# Altium project SensWear-V1R0.PrjPcb (part 1 of 2)
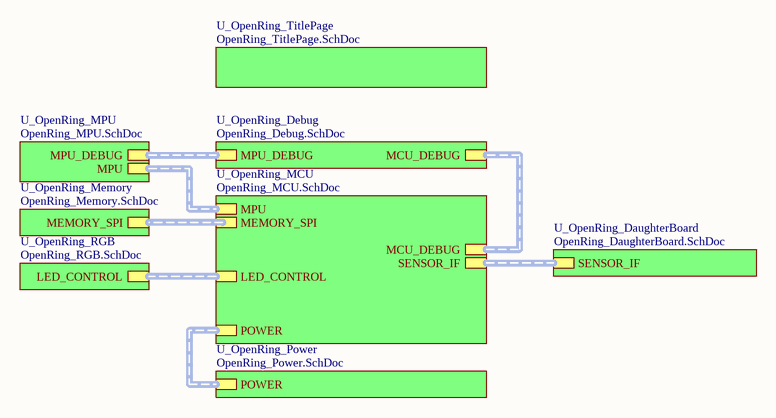
[diagram p0: SensWear-Main.SchDoc]
RevisionDate: 01.05.2025; Revision: A0; Project: SensWear-V1R0; Engineer: Yusein Ali; DrawnBy: Yusein Ali; BoardName: SensWear-RevA; ApprovedBy: Dariush Salami
9 sheets, 74 parts. Net scope: hierarchical (ports join the sheet entries above them; power ports are global).
Board file: SensWear-V1R0-MainBoard.PcbDoc
Sheets:
  SensWear-Main.SchDoc
  SensWear_MCU.SchDoc
  SensWear_Memory.SchDoc
  SensWear_Power.SchDoc
  SensWear_MPU.SchDoc
  SensWear_RGB.SchDoc
  SensWear_Debug.SchDoc
  SensWear_TitlePage.SchDoc
  SensWear_DaughterBoard.SchDoc

## Sheet SensWear-Main.SchDoc
size A4; Size: A4; ApprovedBy: Dariush Salami; DrawnBy: Yusein Ali; Engineer: Yusein Ali; Revision: A0; SheetNumber: 1; SheetTotal: 9

### Sub-sheets
U_OpenRing_DaughterBoard = OpenRing_DaughterBoard.SchDoc (file not in this document): SENSOR_IF (harness SENSOR_IF)
U_OpenRing_Debug = OpenRing_Debug.SchDoc (file not in this document): MPU_DEBUG (harness MPU_DEBUG), MCU_DEBUG (harness MCU_DEBUG)
U_OpenRing_MCU = OpenRing_MCU.SchDoc (file not in this document): MEMORY_SPI (harness MEMORY_SPI), MPU (harness MPU), SENSOR_IF (harness SENSOR_IF), POWER (harness POWER), MCU_DEBUG (harness MCU_DEBUG), LED_CONTROL (harness LED_CONTROL)
U_OpenRing_Memory = OpenRing_Memory.SchDoc (file not in this document): MEMORY_SPI (harness MEMORY_SPI)
U_OpenRing_MPU = OpenRing_MPU.SchDoc (file not in this document): MPU (harness MPU), MPU_DEBUG (harness MPU_DEBUG)
U_OpenRing_Power = OpenRing_Power.SchDoc (file not in this document): POWER (harness POWER)
U_OpenRing_RGB = OpenRing_RGB.SchDoc (file not in this document): LED_CONTROL (harness LED_CONTROL)
U_OpenRing_TitlePage = OpenRing_TitlePage.SchDoc (file not in this document): no entries

### Buses and harness runs
harness sheet U_OpenRing_DaughterBoard/SENSOR_IF = sheet U_OpenRing_MCU/SENSOR_IF
harness sheet U_OpenRing_Debug/MCU_DEBUG = sheet U_OpenRing_MCU/MCU_DEBUG
harness sheet U_OpenRing_Debug/MPU_DEBUG = sheet U_OpenRing_MPU/MPU_DEBUG
harness sheet U_OpenRing_MCU/LED_CONTROL = sheet U_OpenRing_RGB/LED_CONTROL
harness sheet U_OpenRing_MCU/MEMORY_SPI = sheet U_OpenRing_Memory/MEMORY_SPI
harness sheet U_OpenRing_MCU/MPU = sheet U_OpenRing_MPU/MPU
harness sheet U_OpenRing_MCU/POWER = sheet U_OpenRing_Power/POWER

### Notes on the sheet
- Designer/Engineer
- Drawn By
- Document Name
- Board Title
- Sheet
- of
- Size
- A4
- Approved By
- Rev.
- Date

## Sheet SensWear_MCU.SchDoc
size A3; Size: A4; ApprovedBy: Dariush Salami; DrawnBy: Yusein Ali; Engineer: Yusein Ali; Revision: A0; SheetNumber: 2; SheetTotal: 9
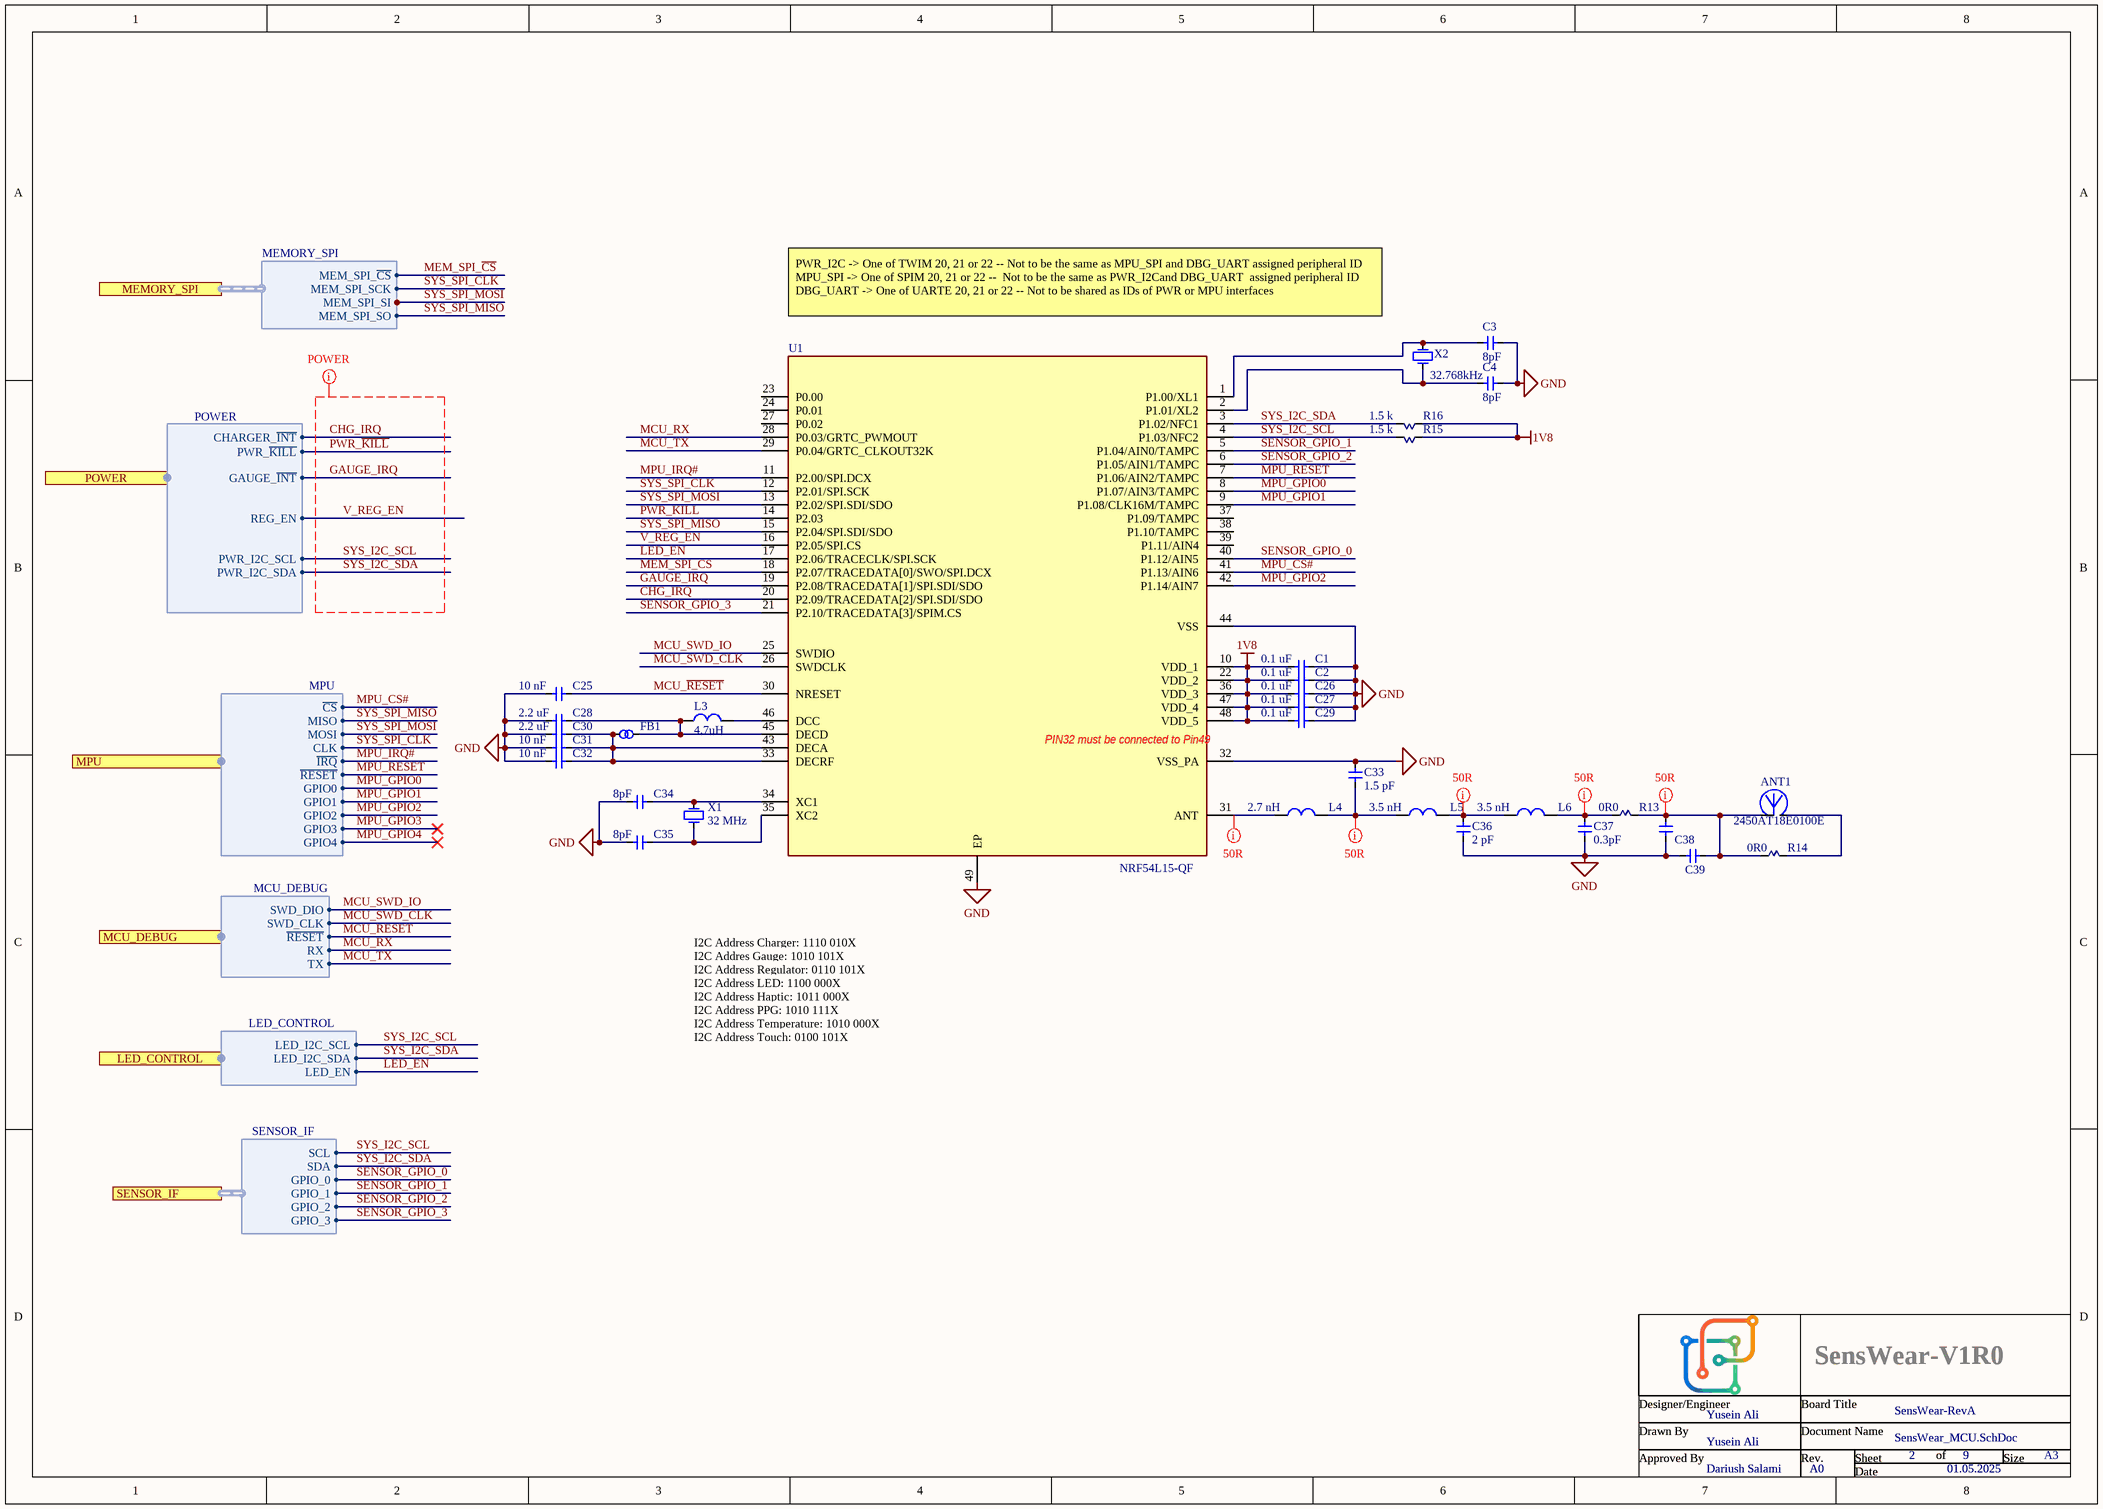
[diagram p1: SensWear_MCU.SchDoc]

### Parts
ANT1  2450AT18E0100E  [ANTC3216X130N]
C1  0.1 uF  [CAPC1005X05N]
C2  0.1 uF  [CAPC1005X05N]
C3  8pF  [CAPC1005X05N]
C4  8pF  [CAPC1005X05N]
C25  10 nF  [CAPC1005X05N]
C26  0.1 uF  [CAPC1005X05N]
C27  0.1 uF  [CAPC1005X05N]
C28  2.2 uF  [CAPC1005X05N]
C29  0.1 uF  [CAPC1005X05N]
C30  2.2 uF  [CAPC1005X05N]
C31  10 nF  [CAPC1005X05N]
C32  10 nF  [CAPC1005X05N]
C33  1.5 pF  [CAPC1005X05N]
C34  8pF  [CAPC1005X05N]
C35  8pF  [CAPC1005X05N]
C36  2 pF  [CAPC1005X05N]
C37  0.3pF  [INDC1005X06N]
C38  NC  [CAPC1005X05N]  (value not drawn)
C39  NC  [CAPC1005X05N]  (value not drawn)
FB1  BLM15AG121SN1D  [INDC1005X06N]  (value not drawn)
L3  4.7uH  [INDC1005X06N]
L4  2.7 nH  [INDC1005X06N]
L5  3.5 nH  [INDC1005X06N]
L6  3.5 nH  [INDC1005X06N]
R13  0R0  [RESC1005X04N]
R14  0R0  [RESC1005X04N]
R15  1.5 k  [RESC1005X04N]
R16  1.5 k  [RESC1005X04N]
U1  NRF54L15-QF  [QFN40P600X600X95-49N]
X1  32 MHz  [FP-ABM11W-MFG]
X2  32.768kHz  [Abracon_ABS6_2012X06L]

### Ports
LED_CONTROL (harness LED_CONTROL), MCU_DEBUG (harness MCU_DEBUG), MEMORY_SPI (harness MEMORY_SPI), MPU (harness MPU), POWER (harness POWER), SENSOR_IF (harness SENSOR_IF)

### Harnesses
MEMORY_SPI: MEM_SPI_~{CS}, MEM_SPI_SI, MEM_SPI_SO, MEM_SPI_SCK
MPU: ~{CS}, MISO, MOSI, CLK, ~{IRQ}, ~{RESET}, GPIO0, GPIO1, GPIO2, GPIO3, GPIO4
POWER: CHARGER_~{INT}, PWR_I2C_SCL, PWR_~{KILL}, GAUGE_~{INT}, PWR_I2C_SDA, REG_EN
MCU_DEBUG: SWD_DIO, SWD_CLK, ~{RESET}, RX, TX
SENSOR_IF: SCL, SDA, GPIO_0, GPIO_1, GPIO_2, GPIO_3
LED_CONTROL: LED_I2C_SCL, LED_I2C_SDA, LED_EN

### Nets
1V8: C1.1 C2.1 C26.1 C27.1 C29.1 R15.1 R16.1 U1.10(VDD_1) U1.22(VDD_2) U1.36(VDD_3) U1.47(VDD_4) U1.48(VDD_5)
GND: C1.2 C2.2 C3.2 C4.1 C25.1 C26.2 C27.2 C28.1 C29.2 C30.1 C31.1 C32.1 C33.2 C34.1 C35.1 C36.1 C37.1 C38.1 C39.2 U1.32(VSS_PA) U1.44(VSS) U1.49(EP)
CHG_IRQ: U1.20(P2.09/TRACEDATA[2]/SPI.SDI/SDO) ; port POWER.CHARGER_~{INT}
GAUGE_IRQ: U1.19(P2.08/TRACEDATA[1]/SPI.SDI/SDO) ; port POWER.GAUGE_~{INT}
LED_EN: U1.17(P2.06/TRACECLK/SPI.SCK) ; port LED_CONTROL.LED_EN
MCU_~{RESET}: C25.2 U1.30(NRESET) ; port MCU_DEBUG.~{RESET}
MCU_RX: U1.28(P0.03/GRTC_PWMOUT) ; port MCU_DEBUG.RX
MCU_SWD_CLK: U1.26(SWDCLK) ; port MCU_DEBUG.SWD_CLK
MCU_SWD_IO: U1.25(SWDIO) ; port MCU_DEBUG.SWD_DIO
MCU_TX: U1.29(P0.04/GRTC_CLKOUT32K) ; port MCU_DEBUG.TX
MEM_SPI_~{CS}: U1.18(P2.07/TRACEDATA[0]/SWO/SPI.DCX) ; port MEMORY_SPI.MEM_SPI_~{CS}
MPU_CS#: U1.41(P1.13/AIN6) ; port MPU.~{CS}
MPU_GPIO0: U1.8(P1.07/AIN3/TAMPC) ; port MPU.GPIO0
MPU_GPIO1: U1.9(P1.08/CLK16M/TAMPC) ; port MPU.GPIO1
MPU_GPIO2: U1.42(P1.14/AIN7) ; port MPU.GPIO2
MPU_GPIO3: port MPU.GPIO3
MPU_GPIO4: port MPU.GPIO4
MPU_IRQ#: U1.11(P2.00/SPI.DCX) ; port MPU.~{IRQ}
MPU_~{RESET}: U1.7(P1.06/AIN2/TAMPC) ; port MPU.~{RESET}
PWR_~{KILL}: U1.14(P2.03) ; port POWER.PWR_~{KILL}
SENSOR_GPIO_0: U1.40(P1.12/AIN5) ; port SENSOR_IF.GPIO_0
SENSOR_GPIO_1: U1.5(P1.04/AIN0/TAMPC) ; port SENSOR_IF.GPIO_1
SENSOR_GPIO_2: U1.6(P1.05/AIN1/TAMPC) ; port SENSOR_IF.GPIO_2
SENSOR_GPIO_3: U1.21(P2.10/TRACEDATA[3]/SPIM.CS) ; port SENSOR_IF.GPIO_3
SYS_I2C_SCL: R15.2 U1.4(P1.03/NFC2) ; port POWER.PWR_I2C_SCL, port SENSOR_IF.SCL, port LED_CONTROL.LED_I2C_SCL
SYS_I2C_SDA: R16.2 U1.3(P1.02/NFC1) ; port POWER.PWR_I2C_SDA, port SENSOR_IF.SDA, port LED_CONTROL.LED_I2C_SDA
SYS_SPI_CLK: U1.12(P2.01/SPI.SCK) ; port MEMORY_SPI.MEM_SPI_SCK, port MPU.CLK
SYS_SPI_MISO: U1.15(P2.04/SPI.SDI/SDO) ; port MEMORY_SPI.MEM_SPI_SO, port MPU.MISO
SYS_SPI_MOSI: U1.13(P2.02/SPI.SDI/SDO) ; port MEMORY_SPI.MEM_SPI_SI, port MPU.MOSI
V_REG_EN: U1.16(P2.05/SPI.CS) ; port POWER.REG_EN
NetANT1_1: ANT1.1 C38.2 C39.1 R13.2 R14.1
NetANT1_2: ANT1.2 R14.2
NetC3_1: C3.1 U1.1(P1.00/XL1) X2.2(OSC2)
NetC4_2: C4.2 U1.2(P1.01/XL2) X2.1(OSC1)
NetC28_2: C28.2 FB1.2 L3.1 U1.45(DECD)
NetC30_2: C30.2 C31.2 C32.2 FB1.1 U1.33(DECRF) U1.43(DECA)
NetC33_1: C33.1 L4.2 L5.1
NetC34_2: C34.2 U1.34(XC1) X1.3(OSC2)
NetC35_2: C35.2 U1.35(XC2) X1.1(OSC1)
NetC36_2: C36.2 L5.2 L6.1
NetC37_2: C37.2 L6.2 R13.1
NetL3_2: L3.2 U1.46(DCC)
NetL4_1: L4.1 U1.31(ANT)

Not connected (* = marked no-connect by the designer): U1 23(P0.00) 24(P0.01) 27(P0.02) 37(P1.09/TAMPC) 38(P1.10/TAMPC) 39(P1.11/AIN4)

### Layout directives
net class PWR Control: CHG_IRQ, GAUGE_IRQ, PWR_~{KILL}, SYS_I2C_SCL, SYS_I2C_SDA, V_REG_EN
Impedance: 50; rule Width Constraint [Pref Impedance = 50.00ohms    Min Impedance = 50.00ohms    Max Impedance = 50.00ohms]: NetANT1_1, NetC33_1, NetC36_2, NetC37_2, NetL4_1

### Notes on the sheet
- PWR_I2C -> One of TWIM 20, 21 or 22 -- Not to be the same as MPU_SPI and DBG_UART assigned peripheral ID
  MPU_SPI -> One of SPIM 20, 21 or 22 --  Not to be the same as PWR_I2Cand DBG_UART  assigned peripheral ID
  DBG_UART -> One of UARTE 20, 21 or 22 -- Not to be shared as IDs of PWR or MPU interfaces
- (near U1) PIN32 must be connected to Pin49
- I2C Address Charger: 1110 010X
- I2C Addres Gauge: 1010 101X
- I2C Address Regulator: 0110 101X
- I2C Address LED: 1100 000X
- I2C Address Haptic: 1011 000X
- I2C Address PPG: 1010 111X
- I2C Address Temperature: 1010 000X
- I2C Address Touch: 0100 101X
- Designer/Engineer
- Drawn By
- Document Name
- Board Title
- Sheet
- of
- Size
- A3
- Approved By
- Rev.
- Date

### Library data of the parts
ANT1 = 2450AT18E0100E: 7 Inch Reel / Mini 2.45Ghz Chip Antenna; Manufacturer: Johanson; Checked: TRUE; Supplier: Mouser; Supplier Part Number: 609-2450AT18E0100E; Manufacturer Part Number: 2450AT18E0100E; RoHS: Yes; Category: RF Antennas; Stock: 4431; Pricing: 1=0.69, 10=0.624, 50=0.624, 100=0.479, 1000=0.303, 10000=0.245 (USD); ComponentLink1URL: https://datasheet.ciiva.com/24048/antenna-2450at18e0100-253355-24048542.pdf?src-supplier=Mouser; ComponentLink1Description: https://datasheet.ciiva.com/24048/antenna-2450at18e0100-253355-24048542.pdf?src-supplier=Mouser; Supplier 1: Mouser; Supplier Part Number 1: 609-2450AT18E0100E
C1 C2 C26 C27 C29 = GRM155R61C104KA88D: CAP CER 0.1UF 16V X5R 0402; Manufacturer: Murata Electronics; Tolerance: 10 %; Type: Chip Multilayer Ceramic Capacitor for General Purpose; Voltage Rating DC: 16 VDC; Capacitance - nF: 100 nF; Capacitance - pF: 100000 pF; Manufacturer Part Number: GRM155R61C104KA88D; RoHS: RoHS Compliant; Category: Multilayer Ceramic Capacitors MLCC - SMD/SMT; Stock: 0; Pricing: 1=0.082, 10=0.026, 100=0.011, 500=0.008, 1000=0.007, 2500=0.006, 5000=0.005, 10000=0.004 (EUR); Capacitance: 0.1 uF; Height: 0.5 mm; Length: 1 mm; Package / Case: 0402 (1005 metric); Packaging: Cut Tape; Product: General Type MLCCs; Series: GRM; Termination Style: SMD/SMT; Width: 0.5 mm; Brand: Murata Electronics; Case Code - in: 0402; Case Code - mm: 1005; Dielectric: X5R; Maximum Operating Temperature: + 85 C; Minimum Operating Temperature: - 55 C; Standard Pack Qty: 10000; Termination: Standard; RoHS - Mouser: Y; Minimum Order Quantity: 1; Reeling: True; ComponentLink1URL: http://www.mouser.com/datasheet/2/281/murata_03052018_GRM_Series_1-1310166.pdf; ComponentLink1Description: http://www.mouser.com/datasheet/2/281/murata_03052018_GRM_Series_1-1310166.pdf; Value: 0.1 uF; Supplier 1: Mouser; Supplier Part Number 1: 81-GRM155R61C104KA8D; Supplier 2: Digikey; Supplier Part Number 2: 490-5415-1-ND; Supplier 3: Digikey; Supplier Part Number 3: 490-5415-6-ND
C3 C4 C34 C35 = GRM1555C1H8R0BA01D: Multilayer Ceramic Capacitors MLCC - SMD/SMT 0402 8.0pF 50volts C0G +/-0.05pF; Manufacturer: Murata; Voltage Rating: 50V; Supplier: Digi-Key; Supplier Part Number: 490-8230-1-ND; Manufacturer Part Number: GRM1555C1H8R0BA01D; RoHS: Yes; Category: Ceramic Capacitors; Stock: 671988; Pricing: 1=0,1, 10=0,051, 50=0,0278, 100=0,0227, 500=0,01624, 1000=0,01276, 2500=0,0116, 5000=0,01067 (USD); Mounting Technology: Surface Mount; Case/Package: 0402; Case Code (Metric): 1005; Case Code (Imperial): 0402; Min Operating Temperature: -55°C; Max Operating Temperature: 125°C; Value: 8pF; Package Quantity: 1; Packaging: Tape and Reel; Series: GRM; Termination: SMD/SMT; Voltage Rating (DC): 50V; Dielectric: C0G; Construction: Flat; Length: 1mm; Width: 0.02inch; Height: 0.5mm; Thickness: 0.022inch; Depth: 0.5mm; Radiation Hardening: No; RoHS Compliant: Yes; Lead Free: Lead Free; ComponentLink1URL: https://datasheet.ciiva.com/18184/getdatasheetpartid-319021-18184500.pdf?src-supplier=Verical; ComponentLink1Description: https://datasheet.ciiva.com/18184/getdatasheetpartid-319021-18184500.pdf?src-supplier=Verical; ComponentLink2URL: https://datasheet.ciiva.com/6263/grm1555c1h820ga01-01-6263780.pdf?src-supplier=Digi-Key; ComponentLink2Description: https://datasheet.ciiva.com/6263/grm1555c1h820ga01-01-6263780.pdf?src-supplier=Digi-Key; ComponentLink3URL: https://datasheet.ciiva.com/5432/product-5432205.pdf?src-supplier=Mouser; ComponentLink3Description: https://datasheet.ciiva.com/5432/product-5432205.pdf?src-supplier=Mouser; ComponentLink4URL: https://datasheet.ciiva.com/11610/product-11610151.pdf?src-supplier=Avnet; ComponentLink4Description: https://datasheet.ciiva.com/11610/product-11610151.pdf?src-supplier=Avnet; ComponentLink5URL: https://datasheet.ciiva.com/16495/c02e-16495287.pdf?src-supplier=Future+Electronics; ComponentLink5Description: https://datasheet.ciiva.com/16495/c02e-16495287.pdf?src-supplier=Future+Electronics; ComponentLink6URL: https://datasheet.ciiva.com/5442/product-5442458.pdf?src-supplier=Mouser; ComponentLink6Description: https://datasheet.ciiva.com/5442/product-5442458.pdf?src-supplier=Mouser; Supplier 1: Mouser; Supplier Part Number 1: 81-GRM1555C1H8R0BA1D; Supplier 2: Digikey; Supplier Part Number 2: 490-8230-1-ND; Supplier 3: Digikey; Supplier Part Number 3: 490-8230-6-ND
C25 C31 C32 = GRM155R71H103KA88D: CAP CER 10000PF 50V X7R 0402; Manufacturer: Murata Electronics North America; Tolerance: ±10%; Supplier 1: Digi-Key; Manufacturer Part Number: GRM155R71H103KA88D; RoHS: RoHS Compliant; Category: Capacitors; Stock 1: 7217649; Pricing 1: 1=0.11, 50=0.0056, 100=0.0047, 250=0.00384, 500=0.0033, 1000=0.00256, 5000=0.00213 (GBP); Packaging: Digi-Reel®; Part Status: Active; Capacitance: 10000pF; Voltage - Rated: 50V; Temperature Coefficient: X7R; Mounting Type: Surface Mount, MLCC; Operating Temperature: -55°C ~ 125°C; Applications: General Purpose; Ratings: -; Package / Case: 0402 (1005 Metric); Size / Dimension: 0.039" L x 0.020" W (1.00mm x 0.50mm); Height - Seated (Max): -; Thickness (Max): 0.022" (0.55mm); Lead Spacing: -; Features: -; Lead Style: -; ComponentLink1URL: http://www.murata.com/~/media/webrenewal/support/library/catalog/products/capacitor/mlcc/c02e.pdf; ComponentLink1Description: http://www.murata.com/~/media/webrenewal/support/library/catalog/products/capacitor/mlcc/c02e.pdf; Supplier Part Number 1: 490-4516-6-ND; Value: 10 nF
C28 C30 = GRM155R61A225KE95D: CAP CER 2.2UF 10V X5R 0402; Manufacturer: Murata Electronics North America; Capacitance: 2.2µF; Tolerance: ±10%; Supplier 1: Digi-Key; Manufacturer Part Number: GRM155R61A225KE95D; RoHS: RoHS Compliant; Category: Capacitors; Stock 1: 370562; Pricing 1: 1=0.1, 10=0.06, 50=0.0326, 100=0.0275, 250=0.02252, 500=0.01926, 1000=0.015, 5000=0.0125 (USD); Packaging: Digi-Reel®; Part Status: Active; Voltage - Rated: 10V; Temperature Coefficient: X5R; Operating Temperature: -55°C ~ 85°C; Features: Derating Recommended; Ratings: -; Applications: General Purpose; Mounting Type: Surface Mount, MLCC; Package / Case: 0402 (1005 Metric); Size / Dimension: 0.039" L x 0.020" W (1.00mm x 0.50mm); Height - Seated (Max): -; Thickness (Max): 0.022" (0.55mm); Lead Spacing: -; Lead Style: -; ComponentLink1URL: http://www.murata.com/~/media/webrenewal/support/library/catalog/products/capacitor/mlcc/c02e.ashx; ComponentLink1Description: http://www.murata.com/~/media/webrenewal/support/library/catalog/products/capacitor/mlcc/c02e.ashx; Supplier Part Number 1: 490-10451-6-ND; Value: 2.2 uF
C33 = GJM1555C1H1R5BB01D: Multilayer Ceramic Capacitor, 1.5 pF, 50 V, ï¿½ 0.1pF, C0G (NP0), 0402 [1005 Metric]; Manufacturer: Murata; Material: 4241ConductorMaterial; Supplier: Mouser; Supplier Part Number: 81-GJM1555C1H1R5BB1D; Manufacturer Part Number: GJM1555C1H1R5BB01D; RoHS: Yes; Category: Ceramic Capacitors; Stock: 9670; Pricing: 1=0.1, 10=0.05, 50=0.05, 100=0.03, 1000=0.022, 10000=0.011 (USD); Lead Free: 5697LeadFree; ComponentLink1URL: https://datasheet.ciiva.com/8030/1700191-8030107.pdf?src-supplier=Element14; ComponentLink1Description: https://datasheet.ciiva.com/8030/1700191-8030107.pdf?src-supplier=Element14; ComponentLink2URL: https://datasheet.ciiva.com/26843/getdatasheetpartid-698463-26843693.pdf?src-supplier=Verical; ComponentLink2Description: https://datasheet.ciiva.com/26843/getdatasheetpartid-698463-26843693.pdf?src-supplier=Verical; ComponentLink3URL: https://datasheet.ciiva.com/29542/partnumbering-e-01-29542725.pdf?src-supplier=Digikey; ComponentLink3Description: https://datasheet.ciiva.com/29542/partnumbering-e-01-29542725.pdf?src-supplier=Digikey; ComponentLink4URL: https://datasheet.ciiva.com/29542/partnumbering-e-01-29542726.pdf?src-supplier=Digikey; ComponentLink4Description: https://datasheet.ciiva.com/29542/partnumbering-e-01-29542726.pdf?src-supplier=Digikey; ComponentLink5URL: https://datasheet.ciiva.com/16440/l0005e-16440473.pdf?src-supplier=Future+Electronics; ComponentLink5Description: https://datasheet.ciiva.com/16440/l0005e-16440473.pdf?src-supplier=Future+Electronics; Value: 1.5 pF; Supplier 1: Mouser; Supplier Part Number 1: 81-GJM1555C1H1R5BB1D; Supplier 2: Digikey; Supplier Part Number 2: 490-8087-1-ND; Supplier 3: Digikey; Supplier Part Number 3: 490-8087-6-ND
C36 = GJM1555C1H2R0WB01D: 0402 2 pF 50V ±0.05 pF Tolerance C0G SMT Multilayer Ceramic Capacitor; Manufacturer: Murata; Material: 4241ConductorMaterial; Temperature Coefficient: 30ppm/°C; Supplier: Mouser; Supplier Part Number: 81-GJM1555C1H2R0WB1D; Manufacturer Part Number: GJM1555C1H2R0WB01D; RoHS: Yes; Category: Ceramic Capacitors; Stock: 97187; Pricing: 1=0.14, 10=0.077, 50=0.077, 100=0.047, 1000=0.032, 10000=0.019 (USD); Lead Free: 5697LeadFree; ComponentLink1URL: https://datasheet.ciiva.com/26843/getdatasheetpartid-724043-26843695.pdf?src-supplier=Verical; ComponentLink1Description: https://datasheet.ciiva.com/26843/getdatasheetpartid-724043-26843695.pdf?src-supplier=Verical; Supplier 1: Mouser; Supplier Part Number 1: 81-GJM1555C1H2R0WB1D; Supplier 2: Digikey; Supplier Part Number 2: 490-11205-1-ND; Supplier 3: Digikey; Supplier Part Number 3: 490-11205-6-ND; Value: 2 pF
C37 = GJM1555C1HR30WB01D: 0402 0.3 pF 50V ±0.05 pF Tolerance C0G SMT Multilayer Ceramic Capacitor; Manufacturer: Murata; Material: 4241ConductorMaterial; Temperature Coefficient: 30ppm/°C; Supplier: Mouser; Supplier Part Number: 81-GJM1555C1HR30WB1D; Manufacturer Part Number: GJM1555C1HR30WB01D; RoHS: Yes; Category: Ceramic Capacitors; Stock: 24305; Pricing: 1=0.14, 10=0.077, 50=0.077, 100=0.047, 1000=0.031, 10000=0.021 (USD); Mounting Technology: Surface Mount; Case/Package: 0402; Case Code (Metric): 1005; Case Code (Imperial): 0402; Min Operating Temperature: -55°C; Max Operating Temperature: 125°C; Value: 0.3pF; Dielectric: C0G; Voltage Rating (DC): 50V; Packaging: Tape and Reel; Package Quantity: 10000; Termination: SMD/SMT; Series: GJM; Construction: Flat; Voltage Rating: 50V; Length: 1mm; Width: 0.02inch; Height: 0.5mm; Thickness: 0.022inch; Depth: 0.5mm; Radiation Hardening: No; RoHS Compliant: Yes; Lead Free: Lead Free; ComponentLink1URL: https://datasheet.ciiva.com/11617/product-11617574.pdf?src-supplier=Avnet; ComponentLink1Description: https://datasheet.ciiva.com/11617/product-11617574.pdf?src-supplier=Avnet; ComponentLink2URL: https://datasheet.ciiva.com/169/partnumbering-e-01-169995.pdf?src-supplier=Digikey; ComponentLink2Description: https://datasheet.ciiva.com/169/partnumbering-e-01-169995.pdf?src-supplier=Digikey; Supplier 1: Mouser; Supplier Part Number 1: 81-GJM1555C1HR30WB1D; Supplier 2: Digikey; Supplier Part Number 2: 490-11248-1-ND; Supplier 3: Digikey; Supplier Part Number 3: 490-11248-6-ND
C38 C39 = CAPACITOR
FB1 = BLM15AG121SN1D: Ferrite Beads Multi-Layer 120Ohm 25% 100MHz 550mA 190mOhm DCR 0402 Paper T/R; Manufacturer: Murata; Manufacturer Series: BLM15A; Material: Steel,Ferrite; Number of Lines: 1; ESR: 190mR; Impedance: 120R; Max DC Current: 500mA; DC Resistance-Max: 250mR; Shielding: Unshielded; Supplier: Mouser; Supplier Part Number: 81-BLM15AG121SN1D; Manufacturer Part Number: BLM15AG121SN1D; RoHS: Yes; Category: Ferrite Beads and Chips; Stock: 120691; Pricing: 1=0.1, 10=0.043, 50=0.034, 100=0.031, 1000=0.021, 10000=0.013 (USD); Case/Package: 0402; Pins: 2; Case Code (Metric): 1005; Case Code (Imperial): 0402; Core Material: Ferrite; Terminal Finish: Tin; Min Operating Temperature: -55°C; Max Operating Temperature: 125°C; Packaging: Tape and Reel; Max Current Rating: 550mA; Series: BLM15AG_SN; Tolerance: 25%; Test Frequency: 100MHz; RMS Current (Irms): 550mA; Package Quantity: 1; Termination: SMD/SMT; Number of Circuits: 1; Current Rating: 550mA; DC Resistance (DCR): 190mR; Frequency: 100MHz; DC Current: 500mA; Channels: 1; Length: 1mm; Width: 0.5mm; Height: 0.5mm; Depth: 0.55mm; Radiation Hardening: No; RoHS Compliant: Yes; Reach SVHC Compliant: No; Lead Free: Lead Free; Military Standard: Not; Supplier 1: Mouser; Supplier Part Number 1: 81-BLM15AG121SN1D; Supplier 2: Digikey; Supplier Part Number 2: 490-1005-1-ND; Supplier 3: Digikey; Supplier Part Number 3: 490-1005-6-ND
L3 = LQM18FN4R7M00D: Inductor Power Chip Shielded Multi-Layer 4.7uH 20% 1MHz Ferrite 0.08A 0.78Ohm DCR 0603 T/R; Manufacturer: Murata; Self Resonant Frequency: 50MHz; DC Resistance (DCR): 600mR; Current Rating: 80mA; Supplier: Mouser; Supplier Part Number: 81-LQM18FN4R7M00D; Manufacturer Part Number: LQM18FN4R7M00D; RoHS: Yes; Category: Fixed Inductors; Stock: 677; Pricing: 1=0.13, 10=0.11, 50=0.11, 100=0.091, 1000=0.075, 10000=0.06 (USD); Mounting Technology: Surface Mount; Case/Package: 0603; Core Material: Ferrite; Case Code (Metric): 1608; Case Code (Imperial): 0603; Weight: 7.1E-05oz; Min Operating Temperature: -55°C; Max Operating Temperature: 125°C; Tolerance: 20%; Shielding: Shielded; Packaging: Tape and Reel; Value: 4.7uH; Test Frequency: 1MHz; Series: LQM18F; Package Quantity: 1; Saturation Current: 80mA; Max DC Current: 80mA; Termination: SMD/SMT; DC Current: 80mA; Max Current Rating: 80mA; Length: 1.6mm; Width: 0.031inch; Height: 0.8mm; Height - Seated (Max): 0.035inch; Depth: 0.9mm; RoHS Compliant: Yes; Military Standard: Not; Lead Free: Lead Free; ComponentLink1URL: https://datasheet.ciiva.com/30489/0900766b812560c4-30489024.pdf?src-supplier=Rs; ComponentLink1Description: https://datasheet.ciiva.com/30489/0900766b812560c4-30489024.pdf?src-supplier=Rs; ComponentLink2URL: https://datasheet.ciiva.com/1039/l0075s0097lqm18f-1039394.pdf?src-supplier=Digikey; ComponentLink2Description: https://datasheet.ciiva.com/1039/l0075s0097lqm18f-1039394.pdf?src-supplier=Digikey; ComponentLink3URL: https://datasheet.ciiva.com/1039/l0075s0097lqm18f-1039393.pdf?src-supplier=Digikey; ComponentLink3Description: https://datasheet.ciiva.com/1039/l0075s0097lqm18f-1039393.pdf?src-supplier=Digikey; ComponentLink4URL: https://datasheet.ciiva.com/1039/l0075s0097lqm18f-1039395.pdf?src-supplier=Digikey; ComponentLink4Description: https://datasheet.ciiva.com/1039/l0075s0097lqm18f-1039395.pdf?src-supplier=Digikey; ComponentLink5URL: https://datasheet.ciiva.com/3082/l0075s0097lqm18f-3082197.pdf?src-supplier=Avnet; ComponentLink5Description: https://datasheet.ciiva.com/3082/l0075s0097lqm18f-3082197.pdf?src-supplier=Avnet; ComponentLink6URL: https://datasheet.ciiva.com/16390/l0075s0097lqm18f-16390346.pdf?src-supplier=Future+Electronics; ComponentLink6Description: https://datasheet.ciiva.com/16390/l0075s0097lqm18f-16390346.pdf?src-supplier=Future+Electronics; Supplier 1: Mouser; Supplier Part Number 1: 81-LQM18FN4R7M00D; Supplier 2: Digikey; Supplier Part Number 2: 490-4024-1-ND; Supplier 3: Digikey; Supplier Part Number 3: 490-4024-6-ND
L4 = LQG15WH2N7B02D: Inductor Chip 2.7nH 0.1nH Tolerance 2-Pin 0402 Paper T/R; Manufacturer: Murata; Supplier: Mouser; Supplier Part Number: 81-LQG15WH2N7B02D; Manufacturer Part Number: LQG15WH2N7B02D; RoHS: Yes; Category: Fixed Inductors; Stock: 6000; Pricing: 1=0.2, 10=0.161, 50=0.141, 100=0.133, 1000=0.109, 10000=0.088 (USD); Value: 2.7 nH; Supplier 1: Mouser; Supplier Part Number 1: 81-LQG15WH2N7B02D; Supplier 2: Digikey; Supplier Part Number 2: 490-LQG15WH2N7B02DDKR-ND; Supplier 3: Digikey; Supplier Part Number 3: 490-LQG15WH2N7B02DCT-ND
L5 L6 = LQG15WH3N5B02D: Inductor Chip 3.5nH 0.1nH Tolerance 2-Pin 0402 Paper T/R; Manufacturer: Murata; Supplier: Mouser; Supplier Part Number: 81-LQG15WH3N5B02D; Manufacturer Part Number: LQG15WH3N5B02D; RoHS: Yes; Category: Fixed Inductors; Stock: 9594; Pricing: 1=0.24, 10=0.187, 50=0.187, 100=0.146, 1000=0.113, 10000=0.09 (USD); Supplier 1: Mouser; Supplier Part Number 1: 81-LQG15WH3N5B02D; Supplier 2: Farnell; Supplier Part Number 2: 3639288; Supplier 3: Farnell; Supplier Part Number 3: 3639288RL; Value: 3.5 nH
R13 R14 = ERJ-2GE0R00X: RES SMD 0.0OHM JUMPER 1/10W 0402; Manufacturer: Panasonic Electronic Components; Resistance (Ohms): 0.0; Power (Watts): 0.1W, 1/10W; Supplier 1: Digi-Key; Manufacturer Part Number: ERJ-2GE0R00X; RoHS: RoHS Compliant; Category: Resistors; Stock 1: 6022701; Pricing 1: 1=0.07, 50=0.0104, 100=0.0078, 250=0.00584, 500=0.0043, 1000=0.00287, 5000=0.00202 (GBP); Packaging: Digi-Reel®; Part Status: Active; Tolerance: Jumper; Composition: Thick Film; Features: Automotive AEC-Q200; Temperature Coefficient: -; Operating Temperature: -55°C ~ 155°C; Package / Case: 0402 (1005 Metric); Supplier Device Package: 0402; Size / Dimension: 0.039" L x 0.020" W (1.00mm x 0.50mm); Height: 0.016" (0.40mm); Number of Terminations: 2; ComponentLink1URL: http://industrial.panasonic.com/www-cgi/jvcr13pz.cgi?E+PZ+3+AOA0001+ERJ2GE0R00X+7+WW; ComponentLink1Description: http://industrial.panasonic.com/www-cgi/jvcr13pz.cgi?E+PZ+3+AOA0001+ERJ2GE0R00X+7+WW; Supplier Part Number 1: P0.0JDKR-ND; Value: 0R0
R15 R16 = ERJ-2RKF1501X: RES SMD 1.5K OHM 1% 1/10W 0402; Manufacturer: Panasonic Electronic Components; Power (Watts): 0.1W, 1/10W; Temperature Coefficient: ±100ppm/°C; Supplier 1: Digi-Key; Manufacturer Part Number: ERJ-2RKF1501X; RoHS: RoHS Compliant; Category: Resistors; Stock 1: 1349197; Pricing 1: 1=0.1, 10=0.025, 25=0.018, 50=0.0136, 100=0.01, 250=0.00764, 500=0.00612, 1000=0.00451, 5000=0.00323 (USD); Packaging: Digi-Reel®; Part Status: Active; Resistance (Ohms): 1.5k; Tolerance: ±1%; Composition: Thick Film; Features: Automotive AEC-Q200; Operating Temperature: -55°C ~ 155°C; Package / Case: 0402 (1005 Metric); Supplier Device Package: 0402; Size / Dimension: 0.039" L x 0.020" W (1.00mm x 0.50mm); Height - Seated (Max): 0.016" (0.40mm); Number of Terminations: 2; Failure Rate: -; ComponentLink1URL: https://industrial.panasonic.com/cdbs/www-data/pdf/RDA0000/AOA0000C283.pdf; ComponentLink1Description: https://industrial.panasonic.com/cdbs/www-data/pdf/RDA0000/AOA0000C283.pdf; Supplier Part Number 1: P1.50KLDKR-ND; Value: 1.5 k
U1 = NRF54L15-QFAA-R: nRF54L15 SoC with Arm Cortex-M33 processor; Manufacturer: Nordic Semiconductor; Supplier: Mouser; Supplier Part Number: 949-NRF54L15-QFAA-R; Manufacturer Part Number: NRF54L15-QFAA-R; RoHS: No; Category: RF Receivers, Transceivers; Stock: 719; Pricing: 1=6.84, 10=6.11, 50=6.11, 100=5.02, 1000=3.62, 10000=3.07 (USD)
X1 = ABM11W-32.0000MHZ-8-B1U-T3: CRYSTAL 32.0000MHZ 8PF SMD, 2x1.6mm, RoHS; Manufacturer: Abracon; Checked: TRUE; Manufacturer Part Number: ABM11W-32.0000MHZ-8-B1U-T3; RoHS: Yes; Category: Crystals; Frequency: 32 MHz; ComponentLink1URL: https://abracon.com/Resonators/ABM11W.pdf?src-supplier=Digikey; ComponentLink1Description: https://abracon.com/Resonators/ABM11W.pdf?src-supplier=Digikey; Supplier 1: Mouser; Supplier Part Number 1: 815-11W32-8B1UT; Supplier 2: Digikey; Supplier Part Number 2: 535-13899-1-ND; Supplier 3: Digikey; Supplier Part Number 3: 535-13899-6-ND; Supplier 4: Digikey; Supplier Part Number 4: 535-13899-2-ND; Supplier: Digikey; Supplier Part Number: 535-13899-1-ND; Stock: 52771; Pricing: 1=0.82, 10=0.709, 50=0.6394, 100=0.6115, 500=0.5517, 1000=0.52788 (USD); ComponentLink2URL: https://datasheet.octopart.com/ABM11W-32.0000MHZ-8-B1U-T3-Abracon-datasheet-112015802.pdf?src-supplier=Master+Electronics; ComponentLink2Description: https://datasheet.octopart.com/ABM11W-32.0000MHZ-8-B1U-T3-Abracon-datasheet-112015802.pdf?src-supplier=Master+Electronics
X2 = ABS06-32.768KHZ-1-T: CRYSTAL 32.768 KHZ 12.5 PF SMD; Manufacturer: Abracon Corporation; Frequency Tolerance: ±10ppm; Load Capacitance: 12.5pF; ESR (Equivalent Series Resistance): 90 kOhm; Operating Mode: Fundamental; Supplier 1: Digi-Key; Manufacturer Part Number: ABS06-32.768KHZ-1-T; RoHS: RoHS Compliant; Category: Crystals and Oscillators; Stock 1: 6467; Pricing 1: 1=2.25, 10=1.952, 50=1.711, 100=1.3508, 500=1.14066, 750=0.99659, 1000=0.90053 (EUR); Packaging: Digi-Reel®; Type: kHz Crystal (Tuning Fork); Frequency: 32.768kHz; Frequency Stability: -; Operating Temperature: -40°C ~ 85°C; Ratings: -; Mounting Type: Surface Mount; Package / Case: 2-SMD; Size / Dimension: 0.079" L x 0.047" W (2.00mm x 1.20mm); Height: 0.024" (0.60mm); ComponentLink1URL: http://www.abracon.com/Resonators/ABS06.pdf; ComponentLink1Description: http://www.abracon.com/Resonators/ABS06.pdf; Supplier Part Number 1: 535-10248-6-ND

## Sheet SensWear_Memory.SchDoc
size A4; Size: A4; ApprovedBy: Dariush Salami; DrawnBy: Yusein Ali; Engineer: Yusein Ali; Revision: A0; SheetNumber: 3; SheetTotal: 9
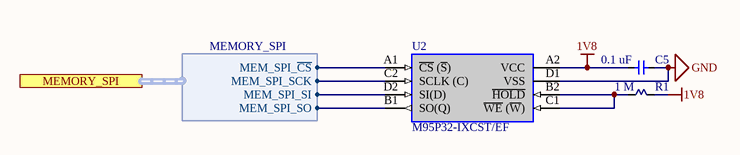
[diagram p2: SensWear_Memory.SchDoc]

### Parts
C5  0.1 uF  [CAPC1005X05N]
R1  1 M  [RESC1005X04N]
U2  M95P32-IXCST/EF  [BGA8C70P2X4_153X261X58]

### Ports
MEMORY_SPI (harness MEMORY_SPI)

### Harnesses
MEMORY_SPI: MEM_SPI_~{CS}, MEM_SPI_SI, MEM_SPI_SO, MEM_SPI_SCK

### Nets
1V8: C5.2 R1.2 U2.A2(VCC)
GND: C5.1 U2.D1(VSS)
NetR1_1: R1.1 U2.B2(~{HOLD}) U2.C1(~{WE}_(~{W}))
NetU2_A1: U2.A1(~{CS}_(~{S})) ; port MEMORY_SPI.MEM_SPI_~{CS}
NetU2_B1: U2.B1(SO(Q)) ; port MEMORY_SPI.MEM_SPI_SO
NetU2_C2: U2.C2(SCLK_(C)) ; port MEMORY_SPI.MEM_SPI_SCK
NetU2_D2: U2.D2(SI(D)) ; port MEMORY_SPI.MEM_SPI_SI

### Notes on the sheet
- Designer/Engineer
- Drawn By
- Document Name
- Board Title
- Sheet
- of
- Size
- A4
- Approved By
- Rev.
- Date

### Library data of the parts
C5 = GRM155R61C104KA88D: as C1 on sheet SensWear_MCU; Supplier 1: Mouser; Manufacturer Part Number: GRM155R61C104KA88D; RoHS: RoHS Compliant; Category: Multilayer Ceramic Capacitors MLCC - SMD/SMT; Packaging: Cut Tape; Capacitance: 0.1 uF; Package / Case: 0402 (1005 metric); ComponentLink1URL: http://www.mouser.com/datasheet/2/281/murata_03052018_GRM_Series_1-1310166.pdf; ComponentLink1Description: http://www.mouser.com/datasheet/2/281/murata_03052018_GRM_Series_1-1310166.pdf; Supplier Part Number 1: 81-GRM155R61C104KA8D; Value: 0.1 uF; Stock: 0; Pricing: 1=0.082, 10=0.026, 100=0.011, 500=0.008, 1000=0.007, 2500=0.006, 5000=0.005, 10000=0.004 (EUR); Height: 0.5 mm; Length: 1 mm; Product: General Type MLCCs; Series: GRM; Termination Style: SMD/SMT; Width: 0.5 mm; Brand: Murata Electronics; Case Code - in: 0402; Case Code - mm: 1005; Dielectric: X5R; Maximum Operating Temperature: + 85 C; Minimum Operating Temperature: - 55 C; Standard Pack Qty: 10000; Termination: Standard; RoHS - Mouser: Y; Minimum Order Quantity: 1; Reeling: True; Supplier 2: Digikey; Supplier Part Number 2: 490-5415-1-ND; Supplier 3: Digikey; Supplier Part Number 3: 490-5415-6-ND
R1 = ERJ-2RKF1004X: RES SMD 1M OHM 1% 1/10W 0402; Manufacturer: Panasonic Electronic Components; Power (Watts): 0.1W, 1/10W; Temperature Coefficient: ±100ppm/°C; Supplier 1: Digi-Key; Manufacturer Part Number: ERJ-2RKF1004X; RoHS: RoHS Compliant; Category: Resistors; Stock 1: 1590446; Pricing 1: 1=0.1, 10=0.025, 25=0.018, 50=0.0136, 100=0.01, 250=0.00764, 500=0.00612, 1000=0.00451, 5000=0.00323 (USD); Packaging: Digi-Reel®; Part Status: Active; Resistance (Ohms): 1M; Tolerance: ±1%; Composition: Thick Film; Features: Automotive AEC-Q200; Operating Temperature: -55°C ~ 155°C; Package / Case: 0402 (1005 Metric); Supplier Device Package: 0402; Size / Dimension: 0.039" L x 0.020" W (1.00mm x 0.50mm); Height - Seated (Max): 0.016" (0.40mm); Number of Terminations: 2; Failure Rate: -; ComponentLink1URL: https://industrial.panasonic.com/cdbs/www-data/pdf/RDA0000/AOA0000C283.pdf; ComponentLink1Description: https://industrial.panasonic.com/cdbs/www-data/pdf/RDA0000/AOA0000C283.pdf; Supplier Part Number 1: P1.00MLDKR-ND; Value: 1 M
U2 = M95P32-IXCST/EF: M95P32-I Series 32 Mb (4 M x 8) 80 MHz SPI EEPROM Memory IC - WLCSP-8; Manufacturer: STMicroelectronics; Supplier: Digikey; Supplier Part Number: 497-M95P32-IXCST/EFDKR-ND; Manufacturer Part Number: M95P32-IXCST/EF; RoHS: No; Category: Memory; Stock: 9222; Pricing: 1=2.68, 10=2.409, 25=2.2724, 100=1.9362, 250=1.818, 500=1.59076, 1000=1.31805, 2500=1.22715 (USD); Supplier 1: Mouser; Supplier Part Number 1: 511-M95P32-IXCST/EF; Supplier 2: Digikey; Supplier Part Number 2: 497-M95P32-IXCST/EFCT-ND